# EAGLE design AC Project thru hole V 1.02 (EAGLE 6.5.0)
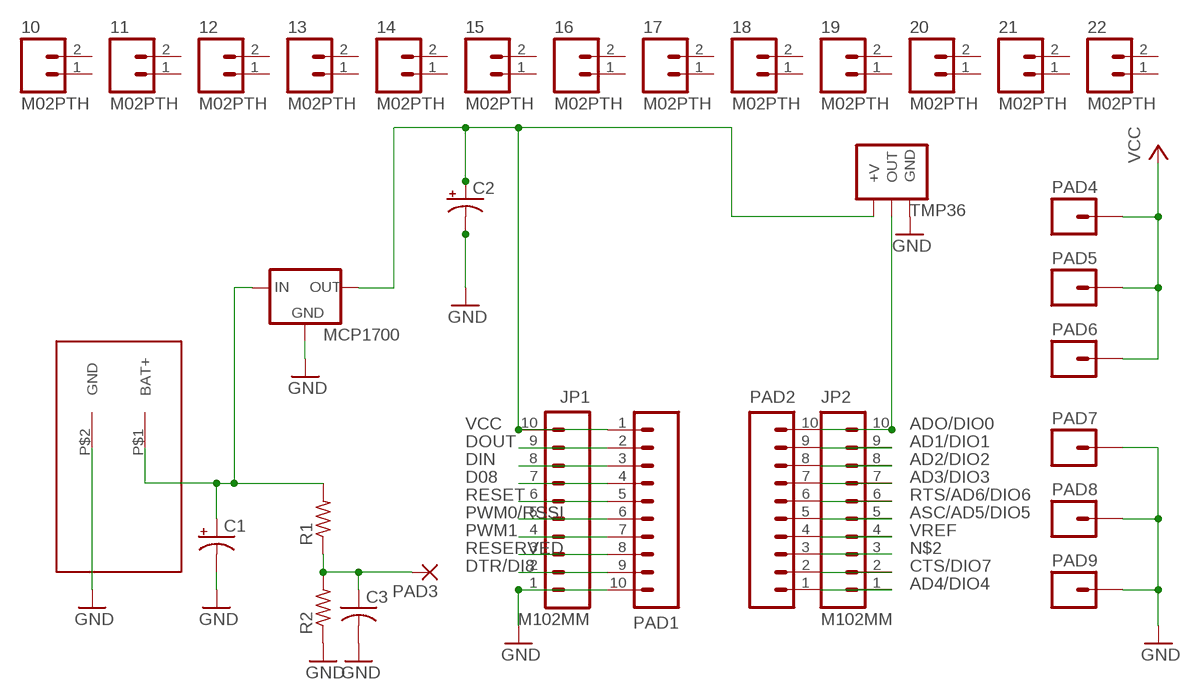
[diagram p0: schematic, sheet 1]

## Parts
10  M02PTH  [1X02]
11  M02PTH  [1X02]
12  M02PTH  [1X02]
13  M02PTH  [1X02]
14  M02PTH  [1X02]
15  M02PTH  [1X02]
16  M02PTH  [1X02]
17  M02PTH  [1X02]
18  M02PTH  [1X02]
19  M02PTH  [1X02]
20  M02PTH  [1X02]
21  M02PTH  [1X02]
22  M02PTH  [1X02]
C1  CPOL-USE1.8-4  [E1,8-4]
C2  CPOL-USE1.8-4  [E1,8-4]
C3  C-US050-030X075  [C050-030X075]
JP1  M102MM  [1X10-2MM]
JP2  M102MM  [1X10-2MM]
MCP1700  MCP1700INLINE  [TO92-INLINE]
PAD1  M10"  [1X10]
PAD2  M10"  [1X10]
PAD3  1,6/0,8  [1,6/0,8]
PAD4  M01PTH  [1X01]
PAD5  M01PTH  [1X01]
PAD6  M01PTH  [1X01]
PAD7  M01PTH  [1X01]
PAD8  M01PTH  [1X01]
PAD9  M01PTH  [1X01]
R1  R-US_0207/10  [0207/10]
R2  R-US_0207/10  [0207/10]
TMP36  TMP36INLINE  [TO92-INLINE]
U$2  AAA_3X_HOLDERAAA_3X_HOLDER_THROUGH_HOLE  [AAA_3X_HOLDER]

## Nets
AD1/DIO1: JP2.9 PAD2.9
AD2/DIO2: JP2.8 PAD2.8
AD3/DIO3: JP2.7 PAD2.7
AD4/DIO4: JP2.1 PAD2.1
ADO/DIO0: JP2.10 PAD2.10 TMP36.2(OUT)
ASC/AD5/DIO5: JP2.5 PAD2.5
CTS/DIO7: JP2.2 PAD2.2
D08: JP1.7 PAD1.4
DIN: JP1.8 PAD1.3
DOUT: JP1.9 PAD1.2
DTR/DI8: JP1.2 PAD1.9
GND: C1.- C2.- C3.2 JP1.1 MCP1700.1(GND) PAD1.10 PAD7.1 PAD8.1 PAD9.1 R2.1 TMP36.3(GND) U$2.P$2(GND)
N$1: C1.+ MCP1700.2(IN) R1.2 U$2.P$1(BAT+)
N$2: JP2.3 PAD2.3
N$11: C3.1 PAD3.1(P) R1.1 R2.2
PWM0/RSSI: JP1.5 PAD1.6
PWM1: JP1.4 PAD1.7
RESERVED: JP1.3 PAD1.8
RESET: JP1.6 PAD1.5
RTS/AD6/DIO6: JP2.6 PAD2.6
VCC: C2.+ JP1.10 MCP1700.3(OUT) PAD1.1 PAD4.1 PAD5.1 PAD6.1 TMP36.1(+V)
VREF: JP2.4 PAD2.4
Unconnected: 10.1 10.2 11.1 11.2 12.1 12.2 13.1 13.2 14.1 14.2 15.1 15.2 16.1 16.2 17.1 17.2 18.1 18.2 19.1 19.2 20.1 20.2 21.1 21.2 22.1 22.2

## Library data of the parts
10-22 = sparkfunconnector:M02: Standard 2-pin 0.1" header. Use with - straight break away headers ( PRT-00116) - right angle break away headers (PRT-00553) - swiss pins (PRT-00743) - machine pins (PRT-00117) - female headers (PRT-00115) Molex polarized connector foot print use with: PRT-08233 with associated crimp pins and housings. 2.54_SCREWTERM for use with PRT-10571. 3.5mm Screw Terminal footprints for PRT-08084 5mm Screw Terminal footprints for use with PRT-08433
C1 C2 = resistor:CPOL-US: POLARIZED CAPACITOR, American symbol
C3 = resistor:C-US: CAPACITOR, American symbol
JP1 JP2 PAD1 PAD2 = sparkfunconnector:M10: Header 10 Standard 10-pin 0.1" header. Use with straight break away headers (SKU : PRT-00116), right angle break away headers (PRT-00553), swiss pins (PRT-00743), machine pins (PRT-00117), and female headers (PRT-00115).
MCP1700 = adafruit:MCP1700: VOLTAGE REGULATOR
PAD3 = wirepad:1,6/0,8: THROUGH-HOLE PAD
PAD4-PAD9 = sparkfunconnector:M01: Header 1 Standard 1-pin 0.1" header. Use with straight break away headers (SKU : PRT-00116), right angle break away headers (PRT-00553), swiss pins (PRT-00743), machine pins (PRT-00117), and female headers (PRT-00115).
R1 R2 = resistor:R-US_: RESISTOR, American symbol
TMP36 = Chris:TMP36: TMP36
U$2 = Leppard2:AAA_3X_HOLDER

## Board
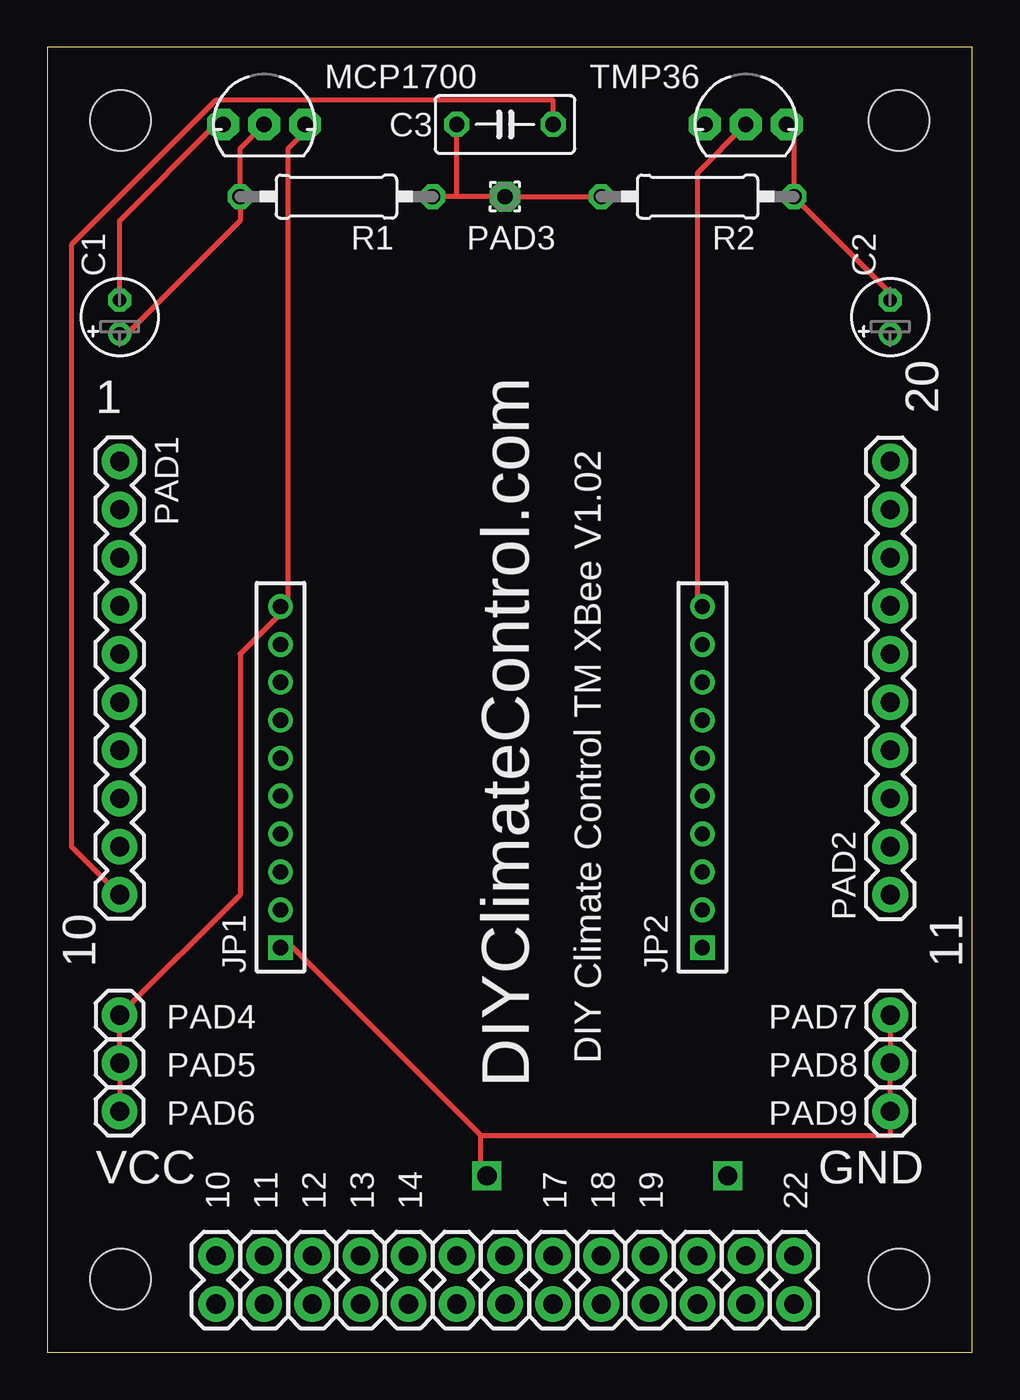
[diagram p1: board, top side]
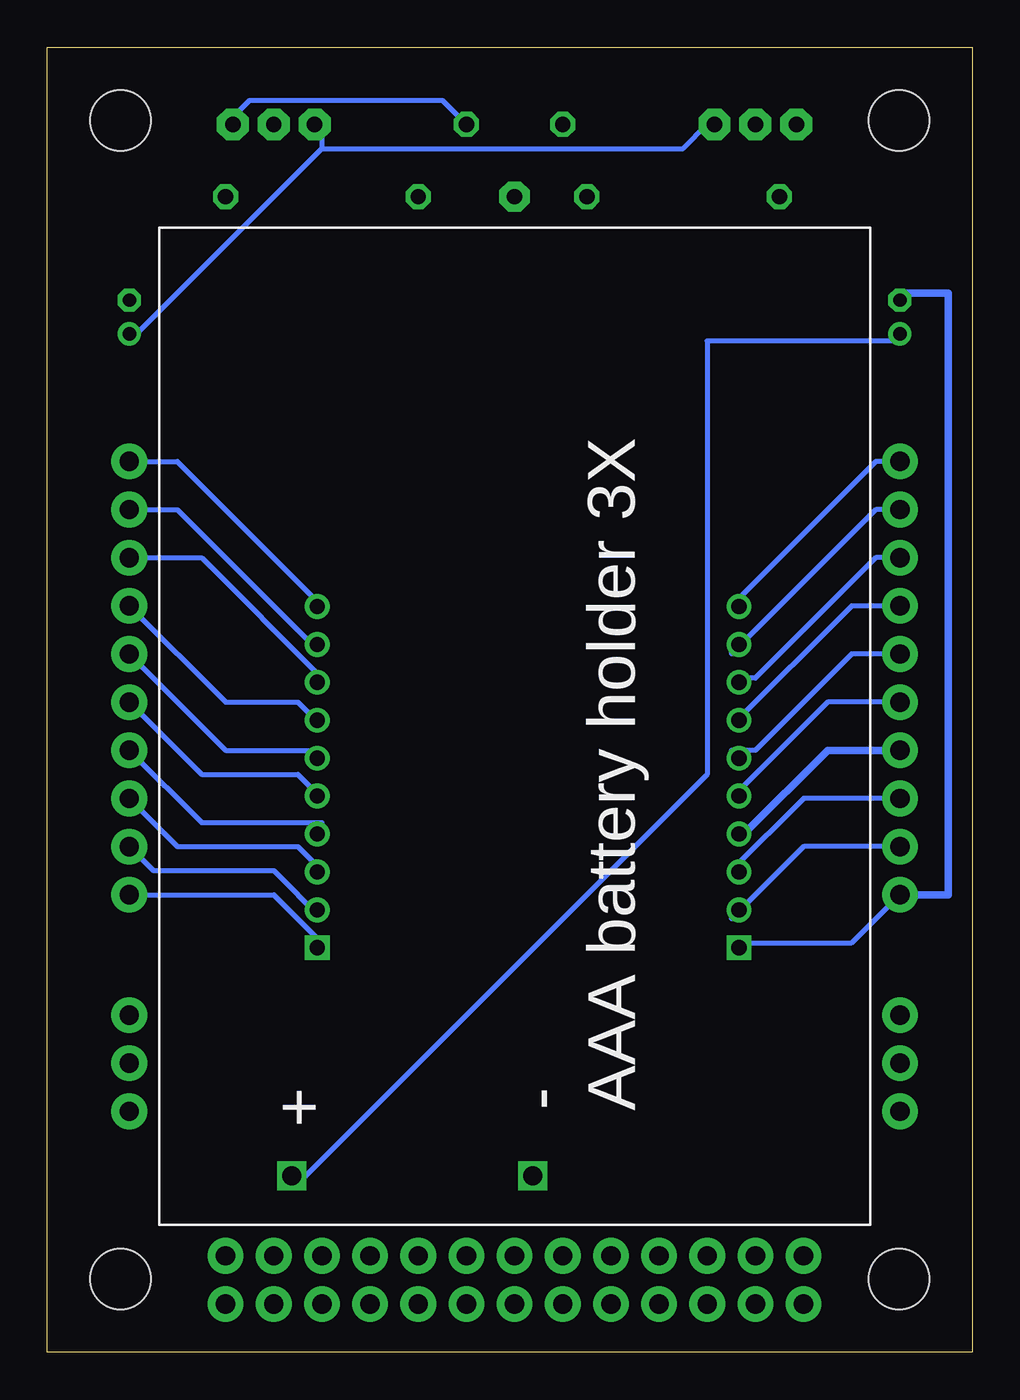
[diagram p2: board, bottom side, seen from below]

Size 48.77 x 68.83 mm. Coordinates in mm from the lower left corner, seen from the top.
Outline: 0,0 48.77,0 48.77,68.83 0,68.83 0,0
Copper layers (1*16): Top 0.035mm / dielectric 1.5mm / Bottom 0.035mm
Design rules "default *": minimum track width 10mil, minimum drill 0.6mm, track to track 10mil, track to pad 10mil, pad to pad 10mil, via to via 10mil, smd to smd 10mil, copper to edge 40mil, drill to drill 8mil, minimum pad ring 10mil, minimum via ring 8mil, stop-mask expansion 4mil, vias tented up to drill 0mil, thermal gap 10mil
Holes 3.2 mm at 3.86,64.97 44.9,64.97 44.9,3.86 3.86,3.86

### Footprints (pad centres in the part's own frame; a part is rotated, then mirrored left to right if it is on the bottom)
1X02 = drill 1.016 pad 1.88: 1 0,0; 2 2.54,0
E1,8-4 = drill 0.711 pad 1.168: + -0.889,0 | drill 0.711 pad 1.168 octagon: - 0.889,0
C050-030X075 = drill 0.813 octagon: 1 -2.54,0; 2 2.54,0
1X10-2MM = drill 0.8 square: 1 0,0 | drill 0.8: 2 2,0; 3 4,0; 4 6,0; 5 8,0; 6 10,0; 7 12,0; 8 14,0; 9 16,0; 10 18,0
TO92-INLINE = drill 0.813 pad 1.676 octagon: 1 -2.159,0; 2 0,0; 3 2.159,0
1X10 = drill 1.016 pad 1.88: 1 0,0; 2 2.54,0; 3 5.08,0; 4 7.62,0; 5 10.16,0; 6 12.7,0; 7 15.24,0; 8 17.78,0; 9 20.32,0; 10 22.86,0
1,6/0,8 = drill 0.813 pad 1.6 octagon: 1 0,0
1X01 = drill 1.016 pad 1.88: 1 0,0
0207/10 = drill 0.813 octagon: 1 -5.08,0; 2 5.08,0
AAA_3X_HOLDER = drill 1.016 square: P$1 23.724,-11.748; P$2 23.724,0.953

### Placement (x,y rotation side)
10  8.89,2.54 90 top
11  11.43,2.54 90 top
12  13.97,2.54 90 top
13  16.51,2.54 90 top
14  19.05,2.54 90 top
15  21.59,2.54 90 top
16  24.13,2.54 90 top
17  26.67,2.54 90 top
18  29.21,2.54 90 top
19  31.75,2.54 90 top
20  34.29,2.54 90 top
21  36.83,2.54 90 top
22  39.37,2.54 90 top
C1  3.81,54.61 90 top
C2  44.45,54.61 90 top
C3  24.13,64.77 0 top
JP1  12.29,21.34 90 top
JP2  34.54,21.34 90 top
MCP1700  11.43,64.77 0 top
PAD1  3.81,46.99 270 top
PAD2  44.45,24.13 90 top
PAD3  24.13,60.96 0 top
PAD4  3.81,17.78 0 top
PAD5  3.81,15.24 0 top
PAD6  3.81,12.7 0 top
PAD7  44.45,17.78 0 top
PAD8  44.45,15.24 0 top
PAD9  44.45,12.7 0 top
R1  15.24,60.96 180 top
R2  34.29,60.96 180 top
TMP36  36.83,64.77 0 top
U$2  24.13,33.02 270 bottom

### Tracks (layer width: path | path; a pad name or v marks a point on that pad's centre or on a via)
AD1/DIO1
  Bottom 0.254: PAD2.9 41.91,44.45 34.29,36.83 JP2.9
AD2/DIO2
  Bottom 0.254: PAD2.8 40.64,41.91 34.29,35.56 JP2.8
AD3/DIO3
  Bottom 0.254: PAD2.7 39.37,34.29 35.56,34.29 34.29,33.02 JP2.7
AD4/DIO4
  Bottom 0.254: PAD2.1 36.83,24.13 34.29,21.59 JP2.1
ADO/DIO0
  Top 0.254: TMP36.2 34.29,62.23 34.29,39.37 JP2.10
  Bottom 0.254: PAD2.10 41.91,46.99 34.29,39.37 JP2.10
ASC/AD5/DIO5
  Bottom 0.254: PAD2.5 40.64,30.48 35.56,30.48 34.29,29.21 JP2.5
CTS/DIO7
  Bottom 0.254: PAD2.2 43.18,25.4 36.83,25.4 34.29,22.86 JP2.2
D08
  Bottom 0.254: PAD1.4 6.35,39.37 12.7,33.02 JP1.7
DIN
  Bottom 0.254: PAD1.3 5.08,41.91 11.43,35.56 12.7,35.56 JP1.8
DOUT
  Bottom 0.254: PAD1.2 5.08,44.45 12.7,36.83 JP1.9
DTR/DI8
  Bottom 0.254: PAD1.9 8.89,26.67 12.7,22.86 JP1.2
GND
  Top 0.254: 22.86,11.43 12.7,21.59 JP1.1 | 22.86,11.43 22.86,8.89 U$2.P$2 | PAD7.1 PAD8.1 PAD9.1 44.45,11.43 22.86,11.43 | C1.- 3.81,59.69 8.89,64.77 MCP1700.1 | C2.- 44.45,55.88 R2.1 39.37,64.77 TMP36.3 | PAD1.10 1.27,26.67 1.27,58.42 8.89,66.04 26.67,66.04 C3.2
  Bottom 0.254: PAD1.10 6.35,21.59 12.7,21.59 JP1.1 | C3.2 27.94,66.04 38.1,66.04 39.37,64.77 TMP36.3
  Bottom 0.406: PAD1.10 1.27,24.13 1.27,55.88 3.81,55.88 C1.-
N$1
  Top 0.254: C1.+ 3.81,53.34 10.16,59.69 R1.2 10.16,63.5 MCP1700.2
  Bottom 0.254: U$2.P$1 35.56,8.89 13.97,30.48 13.97,53.34 3.81,53.34 C1.+
N$2
  Bottom 0.254: PAD2.3 41.91,26.67 35.56,26.67 34.29,25.4 JP2.3
N$11
  Top 0.254: 21.59,60.96 PAD3.1 R2.2 | 21.59,60.96 R1.1 | 21.59,60.96 C3.1
PWM0/RSSI
  Bottom 0.254: PAD1.6 7.62,34.29 12.7,29.21 JP1.5
PWM1
  Bottom 0.406: JP1.4 12.03,27.34 7.62,31.75 PAD1.7
RESERVED
  Bottom 0.254: PAD1.8 8.89,29.21 12.7,25.4 JP1.3
RESET
  Bottom 0.254: PAD1.5 6.35,36.83 11.43,31.75 12.7,31.75 JP1.6
RTS/AD6/DIO6
  Bottom 0.254: PAD2.6 39.37,31.75 34.29,31.75 JP2.6
VCC
  Top 0.254: PAD6.1 PAD5.1 PAD4.1 10.16,24.13 10.16,36.83 12.7,39.37 | 44.45,53.34 C2.+ | 12.7,39.37 12.7,63.5 13.97,64.77 MCP1700.3 | 12.7,39.37 JP1.10
  Bottom 0.254: PAD1.1 5.08,46.99 12.7,39.37 JP1.10 | 34.29,63.5 44.45,53.34 C2.+ | 34.29,63.5 34.29,64.77 TMP36.1 | 34.29,63.5 15.24,63.5 13.97,64.77 MCP1700.3
VREF
  Bottom 0.254: PAD2.4 40.64,27.94 34.29,27.94 JP2.4

### Text on the board
tPlace: 1 | 20 | 10 | 11 | DIY Climate Control TM XBee V1.02 | DIYClimateControl.com | VCC | GND